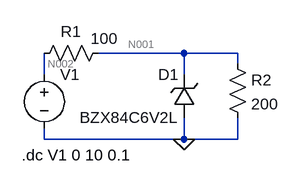
[diagram p0: schematic Zener_regulator.asc]
Zener_regulator.asc, the LTspice schematic file:
Version 4
SHEET 1 880 680
WIRE 240 80 112 80
WIRE 320 80 240 80
WIRE 320 96 320 80
WIRE 32 112 32 80
WIRE 240 112 240 80
WIRE 32 208 32 192
WIRE 240 208 240 176
WIRE 240 208 32 208
WIRE 320 208 320 176
WIRE 320 208 240 208
FLAG 240 208 0
SYMBOL zener 256 176 R180
WINDOW 0 24 64 Left 2
WINDOW 3 24 0 Left 2
SYMATTR InstName D1
SYMATTR Value BZX84C6V2L
SYMATTR Description Diode
SYMATTR Type diode
SYMBOL res 128 64 R90
WINDOW 0 0 56 VBottom 2
WINDOW 3 -21 7 VTop 2
SYMATTR InstName R1
SYMATTR Value 100
SYMBOL voltage 32 96 R0
WINDOW 123 0 0 Left 2
WINDOW 39 0 0 Left 2
SYMATTR InstName V1
SYMATTR Value ""
SYMBOL res 304 80 R0
SYMATTR InstName R2
SYMATTR Value 200
TEXT -2 232 Left 2 !.dc V1 0 10 0.1

The netlist it stands for:
* Zener_regulator.asc
D1 0 N001 BZX84C6V2L
R1 N001 N002 100
V1 N002 0
R2 N001 0 200
.model D D
.lib standard.dio
.dc V1 0 10 0.1
.backanno
.end

* Results of the author's LTspice run, read from the files saved beside the schematic
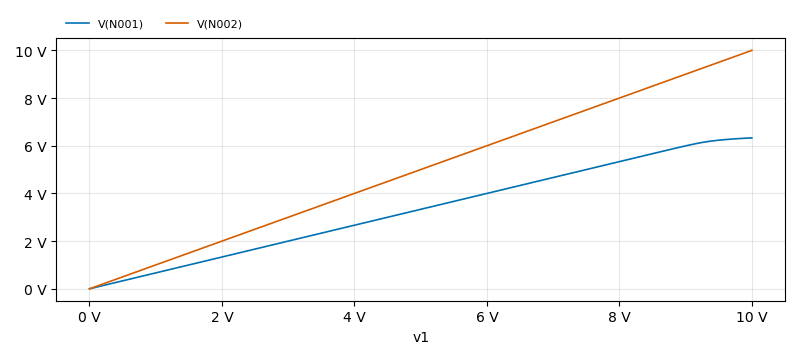
[diagram p1: DC transfer characteristic of Zener_regulator.asc, plotted from the saved traces]
* DC transfer characteristic, 1 run:
*   V(N001): 0 V at v1=0 V, 6.329 V at v1=10 V, min 0 V, max 6.329 V
*   V(N002): 0 V at v1=0 V, 10 V at v1=10 V, min 0 V, max 10 V